# Altium project Buck Converter.PrjPcb
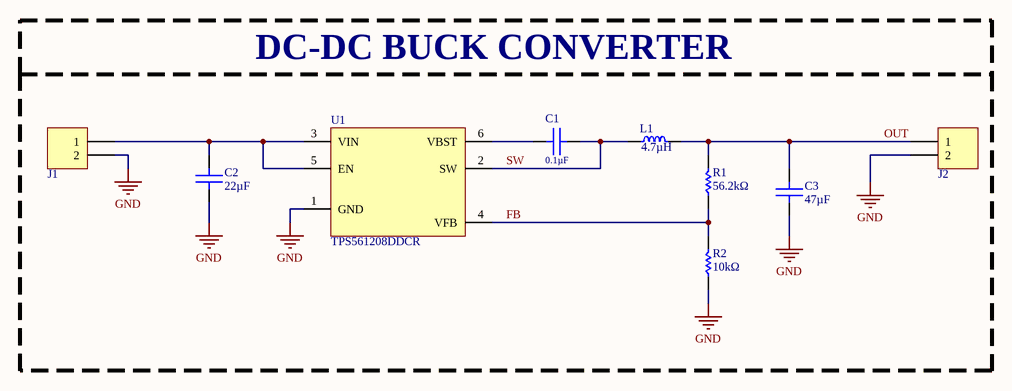
[diagram p0: Buck Converter.SchDoc]
1 sheet, 9 parts. Net scope: global (net labels, ports and power ports of the same name join across sheets).
Board file: Buck Converter.PcbDoc

## Sheet Buck Converter.SchDoc
size A3; SheetNumber: 1; SheetTotal: 1

### Parts
C1  value 0.1µF  [CAP_ALUM_0603]  (hidden comment: CC0603KRX7R9BB104)
C2  value 22µF  [CAP_ALUM_0603]  (hidden comment: GMC10X5R226M16NT)
C3  value 47µF  [CAP_ALUM_0805]  (hidden comment: MLASL21GBB5476MTNA01)
J1  284391-2  [CONNECTOR]  (value not drawn)
J2  284391-2  [CONNECTOR]  (value not drawn)
L1  value 4.7µH  [IND]  (hidden comment: ETQ-P3M4R7KVP)
R1  value 56.2kΩ  [RES_0805]  (hidden comment: ERJ-PB6D5622V)
R2  value 10kΩ  [RES_0805]  (hidden comment: CRCW080510K0FKEA)
U1  TPS561208DDCR  [SOT-23-6]

### Blocks framed on the sheet
DC-DC BUCK CONVERTER: C1-C3 J1 J2 L1 R1 R2 U1

### Nets
GND: C2.1 C3.1 J1.2 J2.2 R2.1 U1.1(GND)
FB: R1.1 R2.2 U1.4(VFB)
OUT: C3.2 J2.1 L1.2 R1.2
SW: C1.2 L1.1 U1.2(SW)
NetC1_1: C1.1 U1.6(VBST)
NetC2_2: C2.2 J1.1 U1.3(VIN) U1.5(EN)

### Notes on the sheet
- Dosya Adı / File Name
- Hazırlayan / Prepared By
- Tanım / Description
- Değiştirme Tarihi / Changed Date
- Bölüm / Department
- Onaylayan / Approved By
- Kontrol Eden / Checked By
- Boyut / Size
- Sayfa / Sheet Number
- Revizyon / Revision

### Library data of the parts
C1 = CAP CER 50V 0.1UF: CAP CER 0.1UF 50V X7R 0603; Designed by: Ali; ComponentLink1URL: https://datasheet.octopart.com:443/CC0603KRX7R9BB104-Yageo-datasheet-177165144.pdf?src-supplier=IHS; ComponentLink1Description: https://datasheet.octopart.com:443/CC0603KRX7R9BB104-Yageo-datasheet-177165144.pdf?src-supplier=IHS; ComponentLink2URL: https://datasheet.octopart.com:443/CC0603KRX7R9BB104-Yageo-datasheet-82288757.pdf?src-supplier=Upverter; ComponentLink2Description: https://datasheet.octopart.com:443/CC0603KRX7R9BB104-Yageo-datasheet-82288757.pdf?src-supplier=Upverter; ComponentLink3URL: https://datasheet.octopart.com:443/CC0603KRX7R9BB104-Yageo-datasheet-68298032.pdf?src-supplier=Upverter; ComponentLink3Description: https://datasheet.octopart.com:443/CC0603KRX7R9BB104-Yageo-datasheet-68298032.pdf?src-supplier=Upverter; ComponentLink4URL: https://datasheet.octopart.com:443/CC0603KRX7R9BB104-Yageo-Group-datasheet-189192896.pdf?src-supplier=Future+Electronics; ComponentLink4Description: https://datasheet.octopart.com:443/CC0603KRX7R9BB104-Yageo-Group-datasheet-189192896.pdf?src-supplier=Future+Electronics; ComponentLink5URL: https://datasheet.octopart.com:443/CC0603KRX7R9BB104-Yageo-datasheet-166511530.pdf?src-supplier=Future+Electronics; ComponentLink5Description: https://datasheet.octopart.com:443/CC0603KRX7R9BB104-Yageo-datasheet-166511530.pdf?src-supplier=Future+Electronics; ComponentLink6URL: https://datasheet.octopart.com:443/CC0603KRX7R9BB104-Yageo-datasheet-137700082.pdf?src-supplier=Future+Electronics; ComponentLink6Description: https://datasheet.octopart.com:443/CC0603KRX7R9BB104-Yageo-datasheet-137700082.pdf?src-supplier=Future+Electronics; ComponentLink7URL: https://datasheet.octopart.com:443/CC0603KRX7R9BB104-Yageo-datasheet-137700084.pdf?src-supplier=Future+Electronics; ComponentLink7Description: https://datasheet.octopart.com:443/CC0603KRX7R9BB104-Yageo-datasheet-137700084.pdf?src-supplier=Future+Electronics; ComponentLink8URL: https://datasheet.octopart.com:443/CC0603KRX7R9BB104-Yageo-datasheet-27626582.pdf?src-supplier=Future+Electronics; ComponentLink8Description: https://datasheet.octopart.com:443/CC0603KRX7R9BB104-Yageo-datasheet-27626582.pdf?src-supplier=Future+Electronics; ComponentLink9URL: https://datasheet.octopart.com:443/CC0603KRX7R9BB104-Yageo-datasheet-15895757.pdf?src-supplier=Future+Electronics; ComponentLink9Description: https://datasheet.octopart.com:443/CC0603KRX7R9BB104-Yageo-datasheet-15895757.pdf?src-supplier=Future+Electronics; ComponentLink10URL: https://datasheet.octopart.com:443/CC0603KRX7R9BB104-Yageo-datasheet-8324192.pdf?src-supplier=Future+Electronics; ComponentLink10Description: https://datasheet.octopart.com:443/CC0603KRX7R9BB104-Yageo-datasheet-8324192.pdf?src-supplier=Future+Electronics; ComponentLink11URL: https://datasheet.octopart.com/CC0603KRX7R9BB104-Yageo-datasheet-10883670.pdf; ComponentLink11Description: https://datasheet.octopart.com/CC0603KRX7R9BB104-Yageo-datasheet-10883670.pdf; ComponentLink12URL: https://datasheet.octopart.com/CC0603KRX7R9BB104-Yageo-datasheet-12526321.pdf; ComponentLink12Description: https://datasheet.octopart.com/CC0603KRX7R9BB104-Yageo-datasheet-12526321.pdf; ComponentLink13URL: https://datasheet.octopart.com:443/CC0603KRX7R9BB104-Yageo-datasheet-181968726.pdf?src-supplier=Newark; ComponentLink13Description: https://datasheet.octopart.com:443/CC0603KRX7R9BB104-Yageo-datasheet-181968726.pdf?src-supplier=Newark; ComponentLink14URL: https://datasheet.octopart.com:443/CC0603KRX7R9BB104-Yageo-datasheet-499490.pdf?src-supplier=Newark; ComponentLink14Description: https://datasheet.octopart.com:443/CC0603KRX7R9BB104-Yageo-datasheet-499490.pdf?src-supplier=Newark; ComponentLink15URL: https://datasheet.octopart.com:443/CC0603KRX7R9BB104-Yageo-datasheet-62336348.pdf?src-supplier=Newark; ComponentLink15Description: https://datasheet.octopart.com:443/CC0603KRX7R9BB104-Yageo-datasheet-62336348.pdf?src-supplier=Newark; ComponentLink16URL: https://datasheet.octopart.com:443/CC0603KRX7R9BB104-Yageo-datasheet-147453679.pdf?src-supplier=Newark; ComponentLink16Description: https://datasheet.octopart.com:443/CC0603KRX7R9BB104-Yageo-datasheet-147453679.pdf?src-supplier=Newark; ComponentLink17URL: https://datasheet.octopart.com:443/CC0603KRX7R9BB104-Yageo-datasheet-151948686.pdf?src-supplier=Farnell; ComponentLink17Description: https://datasheet.octopart.com:443/CC0603KRX7R9BB104-Yageo-datasheet-151948686.pdf?src-supplier=Farnell; ComponentLink18URL: https://datasheet.octopart.com:443/CC0603KRX7R9BB104-Yageo-datasheet-500777.pdf?src-supplier=Farnell; ComponentLink18Description: https://datasheet.octopart.com:443/CC0603KRX7R9BB104-Yageo-datasheet-500777.pdf?src-supplier=Farnell; ComponentLink19URL: https://datasheet.octopart.com:443/CC0603KRX7R9BB104-Yageo-datasheet-178019014.pdf?src-supplier=Burklin+Elektronik; ComponentLink19Description: https://datasheet.octopart.com:443/CC0603KRX7R9BB104-Yageo-datasheet-178019014.pdf?src-supplier=Burklin+Elektronik; ComponentLink20URL: https://datasheet.octopart.com:443/CC0603KRX7R9BB104-Yageo-Group-datasheet-165992755.pdf?src-supplier=ODG+(Origin+Data+Global); ComponentLink20Description: https://datasheet.octopart.com:443/CC0603KRX7R9BB104-Yageo-Group-datasheet-165992755.pdf?src-supplier=ODG+(Origin+Data+Global); ComponentLink21URL: https://datasheet.octopart.com:443/CC0603KRX7R9BB104-Yageo-datasheet-140260305.pdf?src-supplier=SOS+electronic; ComponentLink21Description: https://datasheet.octopart.com:443/CC0603KRX7R9BB104-Yageo-datasheet-140260305.pdf?src-supplier=SOS+electronic; ComponentLink22URL: https://datasheet.octopart.com:443/CC0603KRX7R9BB104-Yageo-datasheet-120101875.pdf?src-supplier=Megastar; ComponentLink22Description: https://datasheet.octopart.com:443/CC0603KRX7R9BB104-Yageo-datasheet-120101875.pdf?src-supplier=Megastar; ComponentLink23URL: https://datasheet.octopart.com:443/CC0603KRX7R9BB104-Yageo-datasheet-8701427.pdf?src-supplier=element14; ComponentLink23Description: https://datasheet.octopart.com:443/CC0603KRX7R9BB104-Yageo-datasheet-8701427.pdf?src-supplier=element14; ComponentLink24URL: https://datasheet.octopart.com:443/CC0603KRX7R9BB104-Yageo-datasheet-5301394.pdf?src-supplier=element14; ComponentLink24Description: https://datasheet.octopart.com:443/CC0603KRX7R9BB104-Yageo-datasheet-5301394.pdf?src-supplier=element14; ComponentLink25URL: https://datasheet.octopart.com:443/CC0603KRX7R9BB104-Yageo-datasheet-17600895.pdf?src-supplier=TME; ComponentLink25Description: https://datasheet.octopart.com:443/CC0603KRX7R9BB104-Yageo-datasheet-17600895.pdf?src-supplier=TME; ComponentLink26URL: http://sigma.octopart.com:80/15889575/rohs_statement/Yageo-CC0603KRX7R9BB104.pdf?src-supplier=Compliance+Statements; ComponentLink26Description: http://sigma.octopart.com:80/15889575/rohs_statement/Yageo-CC0603KRX7R9BB104.pdf?src-supplier=Compliance+Statements; ComponentLink27URL: http://sigma.octopart.com:80/rohs_statement/Surface-Mount-Ceramic-Multilayer-Capacitors%3B-General-Purpose-%26-High-Capacitance-Class-2%2C-X7R-Yageo-family-124.pdf?src-supplier=Compliance+Statements; ComponentLink27Description: http://sigma.octopart.com:80/rohs_statement/Surface-Mount-Ceramic-Multilayer-Capacitors%3B-General-Purpose-%26-High-Capacitance-Class-2%2C-X7R-Yageo-family-124.pdf?src-supplier=Compliance+Statements; ComponentLink28URL: http://sigma.octopart.com:80/reach_statement/Surface-Mount-Ceramic-Multilayer-Capacitors%3B-General-Purpose-%26-High-Capacitance-Class-2%2C-X7R-Yageo-family-125.pdf?src-supplier=Compliance+Statements; ComponentLink28Description: http://sigma.octopart.com:80/reach_statement/Surface-Mount-Ceramic-Multilayer-Capacitors%3B-General-Purpose-%26-High-Capacitance-Class-2%2C-X7R-Yageo-family-125.pdf?src-supplier=Compliance+Statements; ComponentLink29URL: http://sigma.octopart.com:80/conflict_mineral_statement/Yageo-company-3.pdf?src-supplier=Compliance+Statements; ComponentLink29Description: http://sigma.octopart.com:80/conflict_mineral_statement/Yageo-company-3.pdf?src-supplier=Compliance+Statements
C2 = CAP CER 16V 22UF: CAP CER 22UF 16V X5R 0603; Designed by: Ali
C3 = CAP CER 10V 47UF: CAP CER 47UF 10V X5R 0805; Designed by: Ali; ComponentLink1URL: https://datasheet.octopart.com:443/MLASL21GBB5476MTNA01-Taiyo-Yuden-datasheet-182109626.pdf?src-supplier=IHS; ComponentLink1Description: https://datasheet.octopart.com:443/MLASL21GBB5476MTNA01-Taiyo-Yuden-datasheet-182109626.pdf?src-supplier=IHS
J1 J2 = 2POS CONNECTOR: TERM BLK 2POS 3.5MM PCB; Designed by: Ali; ComponentLink1URL: https://datasheet.octopart.com:443/TB006-508-02BE-Same-Sky-datasheet-181920258.pdf?src-supplier=Same+Sky; ComponentLink1Description: https://datasheet.octopart.com:443/TB006-508-02BE-Same-Sky-datasheet-181920258.pdf?src-supplier=Same+Sky; ComponentLink2URL: https://datasheet.octopart.com:443/TB006-508-02BE-CUI-Devices-datasheet-175928139.pdf?src-supplier=Same+Sky; ComponentLink2Description: https://datasheet.octopart.com:443/TB006-508-02BE-CUI-Devices-datasheet-175928139.pdf?src-supplier=Same+Sky; ComponentLink3URL: https://datasheet.octopart.com:443/TB006-508-02BE-CUI-Devices-datasheet-144794960.pdf?src-supplier=Same+Sky; ComponentLink3Description: https://datasheet.octopart.com:443/TB006-508-02BE-CUI-Devices-datasheet-144794960.pdf?src-supplier=Same+Sky; ComponentLink4URL: https://datasheet.octopart.com:443/TB006-508-02BE-CUI-Devices-datasheet-180438495.pdf?src-supplier=IHS; ComponentLink4Description: https://datasheet.octopart.com:443/TB006-508-02BE-CUI-Devices-datasheet-180438495.pdf?src-supplier=IHS; ComponentLink5URL: https://datasheet.octopart.com:443/TB006-508-02BE-Same-Sky-datasheet-182881446.pdf?src-supplier=Electro+Sonic; ComponentLink5Description: https://datasheet.octopart.com:443/TB006-508-02BE-Same-Sky-datasheet-182881446.pdf?src-supplier=Electro+Sonic; ComponentLink6URL: https://datasheet.octopart.com:443/TB006-508-02BE-CUI-Devices-datasheet-154730747.pdf?src-supplier=Electro+Sonic; ComponentLink6Description: https://datasheet.octopart.com:443/TB006-508-02BE-CUI-Devices-datasheet-154730747.pdf?src-supplier=Electro+Sonic; ComponentLink7URL: https://datasheet.octopart.com:443/TB006-508-02BE-CUI-Devices-datasheet-175927972.pdf?src-supplier=CUI+Devices+SCT; ComponentLink7Description: https://datasheet.octopart.com:443/TB006-508-02BE-CUI-Devices-datasheet-175927972.pdf?src-supplier=CUI+Devices+SCT; ComponentLink8URL: https://datasheet.octopart.com:443/TB006-508-02BE-CUI-Devices-datasheet-142371922.pdf?src-supplier=Future+Electronics; ComponentLink8Description: https://datasheet.octopart.com:443/TB006-508-02BE-CUI-Devices-datasheet-142371922.pdf?src-supplier=Future+Electronics; ComponentLink9URL: https://datasheet.octopart.com:443/TB006-508-02BE-Same-Sky-datasheet-182050254.pdf?src-supplier=Future+Electronics; ComponentLink9Description: https://datasheet.octopart.com:443/TB006-508-02BE-Same-Sky-datasheet-182050254.pdf?src-supplier=Future+Electronics; ComponentLink10URL: https://datasheet.octopart.com:443/TB006-508-02BE-CUI-Devices-datasheet-175928504.pdf?src-supplier=Future+Electronics; ComponentLink10Description: https://datasheet.octopart.com:443/TB006-508-02BE-CUI-Devices-datasheet-175928504.pdf?src-supplier=Future+Electronics; ComponentLink11URL: https://datasheet.octopart.com:443/TB006-508-02BE-CUI-Devices-datasheet-147843966.pdf?src-supplier=Future+Electronics; ComponentLink11Description: https://datasheet.octopart.com:443/TB006-508-02BE-CUI-Devices-datasheet-147843966.pdf?src-supplier=Future+Electronics; ComponentLink12URL: https://datasheet.octopart.com:443/TB006-508-02BE-Same-Sky-datasheet-189105716.pdf?src-supplier=Master+Electronics; ComponentLink12Description: https://datasheet.octopart.com:443/TB006-508-02BE-Same-Sky-datasheet-189105716.pdf?src-supplier=Master+Electronics; ComponentLink13URL: https://octopart.com:443/opatz8j6/c1?t=fHsI-vJGq0ax3YV4VPVX9765FQLYLnKawkvhVDY2wGW7NsuHLeMmTTnAN8UF06CQPZs48yB-5xz3sL1w5bxWn8qPeiAw10ubbZDHCopwzJcKDiScSo2o5eGfu6tkPQfY8CPLZDvg6-vEfr5aGAxKfcCfYOMvpy_RDBMuQ-hK4ibS6nRTua2f-pcHEJXDh_hBDeocoF22sNH7d1da-SKWMaMDwrpdFRByHucT0U62h2nK3zIbhpnAiH4iZCnOR73LxqY7SbkS3MsMgNkZjyv03hRFiZl1QedJoj0oJD4YkDR3Iwm0DGh6iMs89pr1KypduVaRs30rPEQo-Hyta07xICoRDgViDZT-o4-05qdJ&src-supplier=Compliance+Statements; ComponentLink13Description: https://octopart.com:443/opatz8j6/c1?t=fHsI-vJGq0ax3YV4VPVX9765FQLYLnKawkvhVDY2wGW7NsuHLeMmTTnAN8UF06CQPZs48yB-5xz3sL1w5bxWn8qPeiAw10ubbZDHCopwzJcKDiScSo2o5eGfu6tkPQfY8CPLZDvg6-vEfr5aGAxKfcCfYOMvpy_RDBMuQ-hK4ibS6nRTua2f-pcHEJXDh_hBDeocoF22sNH7d1da-SKWMaMDwrpdFRByHucT0U62h2nK3zIbhpnAiH4iZCnOR73LxqY7SbkS3MsMgNkZjyv03hRFiZl1QedJoj0oJD4YkDR3Iwm0DGh6iMs89pr1KypduVaRs30rPEQo-Hyta07xICoRDgViDZT-o4-05qdJ&src-supplier=Compliance+Statements; ComponentLink14URL: https://octopart.com:443/opatz8j6/c1?t=dM8eYxaDjL-kaGKmpQdjQWWEnU0blebvyTfTg2Rd3ApnP0UDE0_21QnWTJTGPDp9ytAa8tI3FlrDP95A3o_BkvgjWebh62Rb0h4w5pdUEDvMppSZf9I2FkcMVfX_KODmYkYqAUk2J34LktI7ilXeyahGaPsFEFmJ14Qpe_e4WQb7vSWg98nQTbt98nmPt5nbp9Om0G6lN1r0aO0w1HyXWmIGCs0ZKZYERynt6qeI2t6k4UiW3G0ar8-zdiHltbn3Uug6IoKqAm4iCKe5-FP6rZ7LyBAXLGYUwzzXGEbZlMJyi7fV-f2HbCXfbrUN-lArhVr4RKA0cMCPAVhKnfwYpS3HsZn96be7tbt9nomaLsRb7g&src-supplier=Compliance+Statements; ComponentLink14Description: https://octopart.com:443/opatz8j6/c1?t=dM8eYxaDjL-kaGKmpQdjQWWEnU0blebvyTfTg2Rd3ApnP0UDE0_21QnWTJTGPDp9ytAa8tI3FlrDP95A3o_BkvgjWebh62Rb0h4w5pdUEDvMppSZf9I2FkcMVfX_KODmYkYqAUk2J34LktI7ilXeyahGaPsFEFmJ14Qpe_e4WQb7vSWg98nQTbt98nmPt5nbp9Om0G6lN1r0aO0w1HyXWmIGCs0ZKZYERynt6qeI2t6k4UiW3G0ar8-zdiHltbn3Uug6IoKqAm4iCKe5-FP6rZ7LyBAXLGYUwzzXGEbZlMJyi7fV-f2HbCXfbrUN-lArhVr4RKA0cMCPAVhKnfwYpS3HsZn96be7tbt9nomaLsRb7g&src-supplier=Compliance+Statements; ComponentLink15URL: https://octopart.com:443/opatz8j6/c1?t=bw9KZVLlhUqzXoXFRxbELXwAHqW3rYXbl3kz-D70DphFXaJpKM257BgSLnuP8i28oPvEALo2tZA53BhLcUzl5dRb2JOYxLqfI5xvQrkPOl21mmNK4yZO-iltfw1O2MyUgoFo79I6m7IyZirIkd8BTJ6SXlUH-CcdG805aetUs4r3ebpuYTN5yQUnPf8M5eAN6xCifqBWiRhkVNuklpDjmWbPI3nDwC94Sucq-8REIvVdAtJH-q2SkBY-nLcUgY8rcGenqHU6yf7Y4n9YSf-GElQJbIOiT_i1cykaUrV9Yz4c8IA8EYsemTqzfugObHR9KMsqFN2i-Mp5nta0N661Y-6au3dk2z2tQkVn3QdZ&src-supplier=Compliance+Statements; ComponentLink15Description: https://octopart.com:443/opatz8j6/c1?t=bw9KZVLlhUqzXoXFRxbELXwAHqW3rYXbl3kz-D70DphFXaJpKM257BgSLnuP8i28oPvEALo2tZA53BhLcUzl5dRb2JOYxLqfI5xvQrkPOl21mmNK4yZO-iltfw1O2MyUgoFo79I6m7IyZirIkd8BTJ6SXlUH-CcdG805aetUs4r3ebpuYTN5yQUnPf8M5eAN6xCifqBWiRhkVNuklpDjmWbPI3nDwC94Sucq-8REIvVdAtJH-q2SkBY-nLcUgY8rcGenqHU6yf7Y4n9YSf-GElQJbIOiT_i1cykaUrV9Yz4c8IA8EYsemTqzfugObHR9KMsqFN2i-Mp5nta0N661Y-6au3dk2z2tQkVn3QdZ&src-supplier=Compliance+Statements; ComponentLink16URL: https://octopart.com:443/opatz8j6/c1?t=51W4uELkvxqfUgcIORfpkyxNe7hFBhvZiV9jpN1tEL-YWHEtWaoW2GVQnAOGKJV-z-ol0-_zKhVIcSsi0cDlA68krw4fx2Tll0M7j4YXqaaOkm2YpeImxqaVcoAg0sbXHdHWd_xv5ZmzRu1QU3XJyBCDKJVhl-DkFV-Gbea_txV3WYqFkyjjDBkk5sQEpYYc18TquNJ1WUsD0jPnTO40UBXveCrexaP0Dssqdv973MDQ-gsb1JvuQaNQ02QWuz2AHuz4CQI0jUYr4Q0KYYeTWZS-j8dvoUxhQBS5tGPQW3pLx6CMY7iLvYYpoXat0phkzwFSmDBGFA8ZFzihO1kpn-qdPV396rJrWlhwdY9ORzL6zg&src-supplier=Compliance+Statements; ComponentLink16Description: https://octopart.com:443/opatz8j6/c1?t=51W4uELkvxqfUgcIORfpkyxNe7hFBhvZiV9jpN1tEL-YWHEtWaoW2GVQnAOGKJV-z-ol0-_zKhVIcSsi0cDlA68krw4fx2Tll0M7j4YXqaaOkm2YpeImxqaVcoAg0sbXHdHWd_xv5ZmzRu1QU3XJyBCDKJVhl-DkFV-Gbea_txV3WYqFkyjjDBkk5sQEpYYc18TquNJ1WUsD0jPnTO40UBXveCrexaP0Dssqdv973MDQ-gsb1JvuQaNQ02QWuz2AHuz4CQI0jUYr4Q0KYYeTWZS-j8dvoUxhQBS5tGPQW3pLx6CMY7iLvYYpoXat0phkzwFSmDBGFA8ZFzihO1kpn-qdPV396rJrWlhwdY9ORzL6zg&src-supplier=Compliance+Statements
L1 = IND SMD 4.7UH 4.1A: FIXED IND 4.7UH 4.1A 50.16 MOHM; Manufacturer: Panasonic; Manufacturer Part Number: ETQP3M4R7KVP; Manufacturer Lifecycle Status: ACTIVE; Manufacturer Package Identifier: PCC-M0530M-LP; Part Series: Power Choke Coil for Automotive-LP (MC type); Designed by: Ali; DC Resistance (DCR): 50.16mΩ; Inductance Tolerance: 20%; Number of Circuits: 1; Saturation Current: 6.7A; Shielding: Yes; Test Frequency: 100kHz; Supplier: Farnell; Supplier Part Number: 2545717; RoHS: Compliant; Category: Fixed Inductors; Stock: 3910; Pricing: 10=0,574, 100=0,473, 500=0,413, 1000=0,389, 2000=0,374, 4000=0,348 (EUR); Case/Package: 2220; Composition: Wirewound; Country of Origin: Japan; Export Control Classification Number (ECCN) Code: EAR99; Height: 3mm; Harmonized Tariff Schedule (HTS) Code: 8504.50.80.00; Introduction Date: 2016-06-23; Lifecycle Status: Production; Max Current Rating: 4.1A; Max Operating Temperature: 155°C; Min Operating Temperature: -55°C; Mounting Technology: Surface Mount; Number of Terminals: 2; Packaging: Cut Tape; REACH SVHC: Yes; RMS Current (Irms): 4.1A; Schedule B: 8504500000; ESR: 50.16mΩ; Tolerance: 20%; Width: 5mm; ComponentLink1URL: https://datasheet.octopart.com:443/ETQP3M4R7KVP-Panasonic-datasheet-180975437.pdf?src-supplier=IHS; ComponentLink1Description: https://datasheet.octopart.com:443/ETQP3M4R7KVP-Panasonic-datasheet-180975437.pdf?src-supplier=IHS; ComponentLink2URL: https://datasheet.octopart.com:443/ETQP3M4R7KVP-Panasonic-datasheet-98950113.pdf?src-supplier=Panasonic; ComponentLink2Description: https://datasheet.octopart.com:443/ETQP3M4R7KVP-Panasonic-datasheet-98950113.pdf?src-supplier=Panasonic; ComponentLink3URL: https://datasheet.octopart.com:443/ETQP3M4R7KVP-Panasonic-datasheet-136412728.pdf?src-supplier=Newark; ComponentLink3Description: https://datasheet.octopart.com:443/ETQP3M4R7KVP-Panasonic-datasheet-136412728.pdf?src-supplier=Newark; ComponentLink4URL: https://datasheet.octopart.com:443/ETQP3M4R7KVP-Panasonic-datasheet-65850535.pdf?src-supplier=SOS+electronic; ComponentLink4Description: https://datasheet.octopart.com:443/ETQP3M4R7KVP-Panasonic-datasheet-65850535.pdf?src-supplier=SOS+electronic; ComponentLink5URL: https://datasheet.octopart.com:443/ETQP3M4R7KVP-Panasonic-datasheet-66615529.pdf?src-supplier=element14+APAC; ComponentLink5Description: https://datasheet.octopart.com:443/ETQP3M4R7KVP-Panasonic-datasheet-66615529.pdf?src-supplier=element14+APAC; ComponentLink6URL: https://datasheet.octopart.com:443/ETQP3M4R7KVP-Panasonic-datasheet-78834738.pdf?src-supplier=element14+APAC; ComponentLink6Description: https://datasheet.octopart.com:443/ETQP3M4R7KVP-Panasonic-datasheet-78834738.pdf?src-supplier=element14+APAC; ComponentLink7URL: https://datasheet.octopart.com:443/ETQP3M4R7KVP-Panasonic-datasheet-61114973.pdf?src-supplier=element14+APAC; ComponentLink7Description: https://datasheet.octopart.com:443/ETQP3M4R7KVP-Panasonic-datasheet-61114973.pdf?src-supplier=element14+APAC; ComponentLink8URL: https://sigma.octopart.com:443/150570891/technical_drawing/Panasonic-ETQP3M4R7KVP.pdf?src-supplier=Panasonic+SCT; ComponentLink8Description: https://sigma.octopart.com:443/150570891/technical_drawing/Panasonic-ETQP3M4R7KVP.pdf?src-supplier=Panasonic+SCT; ComponentLink9URL: https://datasheet.octopart.com:443/ETQP3M4R7KVP-Panasonic-datasheet-137675050.pdf?src-supplier=TME; ComponentLink9Description: https://datasheet.octopart.com:443/ETQP3M4R7KVP-Panasonic-datasheet-137675050.pdf?src-supplier=TME; ComponentLink10URL: https://datasheet.octopart.com:443/ETQP3M4R7KVP-Panasonic-datasheet-81843036.pdf?src-supplier=Farnell; ComponentLink10Description: https://datasheet.octopart.com:443/ETQP3M4R7KVP-Panasonic-datasheet-81843036.pdf?src-supplier=Farnell
R1 = RES SMD 56.2K OHM 0805: RES SMD 56.2K OHM 0.5% 1/4W 0805; Designed by: Ali; ComponentLink1URL: https://datasheet.octopart.com:443/RP73PF1J56K2BTDF-TE-Connectivity-datasheet-179148511.pdf?src-supplier=IHS; ComponentLink1Description: https://datasheet.octopart.com:443/RP73PF1J56K2BTDF-TE-Connectivity-datasheet-179148511.pdf?src-supplier=IHS; ComponentLink2URL: https://datasheet.octopart.com:443/RP73PF1J56K2BTDF-TE-Connectivity-datasheet-140899247.pdf?src-supplier=IHS; ComponentLink2Description: https://datasheet.octopart.com:443/RP73PF1J56K2BTDF-TE-Connectivity-datasheet-140899247.pdf?src-supplier=IHS; ComponentLink3URL: https://datasheet.octopart.com:443/RP73PF1J56K2BTDF-Tyco-Electronics-datasheet-11516962.pdf?src-supplier=RS+(Formerly+Allied+Electronics); ComponentLink3Description: https://datasheet.octopart.com:443/RP73PF1J56K2BTDF-Tyco-Electronics-datasheet-11516962.pdf?src-supplier=RS+(Formerly+Allied+Electronics); ComponentLink4URL: https://datasheet.octopart.com:443/6-2176089-7-TE-Connectivity---AMP-datasheet-97102182.pdf?src-supplier=Electro+Sonic; ComponentLink4Description: https://datasheet.octopart.com:443/6-2176089-7-TE-Connectivity---AMP-datasheet-97102182.pdf?src-supplier=Electro+Sonic; ComponentLink5URL: https://datasheet.octopart.com:443/RP73PF1J56K2BTDF-Tyco-Electronics-datasheet-11120217.pdf?src-supplier=Farnell; ComponentLink5Description: https://datasheet.octopart.com:443/RP73PF1J56K2BTDF-Tyco-Electronics-datasheet-11120217.pdf?src-supplier=Farnell
R2 = RES SMD 10K OHM 0805: RES SMD 10K OHM 1% 1/4W 0805; Designed by: Ali; ComponentLink1URL: https://datasheet.octopart.com:443/RNCF0603DTE10K0-Stackpole-Electronics-datasheet-182148124.pdf?src-supplier=IHS; ComponentLink1Description: https://datasheet.octopart.com:443/RNCF0603DTE10K0-Stackpole-Electronics-datasheet-182148124.pdf?src-supplier=IHS; ComponentLink2URL: https://datasheet.octopart.com:443/RNCF0603DTE10K0-Stackpole-Electronics-datasheet-141158876.pdf?src-supplier=Stackpole+Electronics; ComponentLink2Description: https://datasheet.octopart.com:443/RNCF0603DTE10K0-Stackpole-Electronics-datasheet-141158876.pdf?src-supplier=Stackpole+Electronics; ComponentLink3URL: https://datasheet.octopart.com:443/RNCF0603DTE10K0-Stackpole-Electronics-datasheet-12511394.pdf?src-supplier=Stackpole+Electronics; ComponentLink3Description: https://datasheet.octopart.com:443/RNCF0603DTE10K0-Stackpole-Electronics-datasheet-12511394.pdf?src-supplier=Stackpole+Electronics; ComponentLink4URL: https://datasheet.octopart.com:443/RNCF0603DTE10K0-Stackpole-Electronics-datasheet-10788241.pdf?src-supplier=Stackpole+Electronics; ComponentLink4Description: https://datasheet.octopart.com:443/RNCF0603DTE10K0-Stackpole-Electronics-datasheet-10788241.pdf?src-supplier=Stackpole+Electronics; ComponentLink5URL: https://datasheet.octopart.com:443/RNCF0603DTE10K0-Stackpole-Electronics-datasheet-155966811.pdf?src-supplier=Electro+Sonic; ComponentLink5Description: https://datasheet.octopart.com:443/RNCF0603DTE10K0-Stackpole-Electronics-datasheet-155966811.pdf?src-supplier=Electro+Sonic; ComponentLink6URL: https://datasheet.octopart.com:443/RNCF0603DTE10K0-Stackpole-Electronics-datasheet-28504821.pdf?src-supplier=Future+Electronics; ComponentLink6Description: https://datasheet.octopart.com:443/RNCF0603DTE10K0-Stackpole-Electronics-datasheet-28504821.pdf?src-supplier=Future+Electronics; ComponentLink7URL: https://datasheet.octopart.com/RNCF0603DTE10K0-Stackpole-Electronics-datasheet-11755897.pdf; ComponentLink7Description: https://datasheet.octopart.com/RNCF0603DTE10K0-Stackpole-Electronics-datasheet-11755897.pdf; ComponentLink8URL: http://sigma.octopart.com:80/15941409/materials_sheet/Stackpole-Electronics-RNCF0603DTE10K0.pdf?src-supplier=Compliance+Statements; ComponentLink8Description: http://sigma.octopart.com:80/15941409/materials_sheet/Stackpole-Electronics-RNCF0603DTE10K0.pdf?src-supplier=Compliance+Statements; ComponentLink9URL: http://sigma.octopart.com:80/141158212/rohs_statement/Stackpole-Electronics-RNCF0603DTE10K0.pdf?src-supplier=Compliance+Statements; ComponentLink9Description: http://sigma.octopart.com:80/141158212/rohs_statement/Stackpole-Electronics-RNCF0603DTE10K0.pdf?src-supplier=Compliance+Statements; ComponentLink10URL: http://sigma.octopart.com:80/141158211/reach_statement/Stackpole-Electronics-RNCF0603DTE10K0.pdf?src-supplier=Compliance+Statements; ComponentLink10Description: http://sigma.octopart.com:80/141158211/reach_statement/Stackpole-Electronics-RNCF0603DTE10K0.pdf?src-supplier=Compliance+Statements
U1 = BUCK SWITCHING 5V 1A: IC REG BUCK ADJ 1A SOT23; Designed by: Ali; ComponentLink1URL: https://datasheet.octopart.com:443/MLASL21GBB5476MTNA01-Taiyo-Yuden-datasheet-182109626.pdf?src-supplier=IHS; ComponentLink1Description: https://datasheet.octopart.com:443/MLASL21GBB5476MTNA01-Taiyo-Yuden-datasheet-182109626.pdf?src-supplier=IHS; ComponentLink2URL: https://sigma.octopart.com:443/180581133/technical_drawing/Texas-Instruments-TPS561208DDCR.pdf?src-supplier=Texas+Instruments; ComponentLink2Description: https://sigma.octopart.com:443/180581133/technical_drawing/Texas-Instruments-TPS561208DDCR.pdf?src-supplier=Texas+Instruments; ComponentLink3URL: https://octopart.com:443/opatz8j6/c1?t=X-b0HHisZbH55NsDw1gLTTjGk-a9CqkXjLyk6wQz6IvtKiHi1FfcTRZ-jtPM-JOr5bQu5O1dXwOa_G9AG1cqx6Rsj9qm9QhslHmtGULxFHJZTPGvjE1_I1l0IDURebwVyeHa78q0f3R3m6KGSACMzktOannogAKMubn1t5dyydMkdTpKes7VihHz0iTczMjt9sgeRYa2cnbtgERBHX1HsZgUHSomXGLzDOvFgPiL8eazJAh9Y_eBqwfhSyfDQ61ZKEDLnD3ZwxjY4kChkzi6x9zuTSfQYIVKf7rNSEGVDXF1NodZ8MRT7-ePkd6k-SI1Q9SbFhD52LhXQb95D5_CoWV6qrtZuyIjyNSt9hbVxuzVMLcV2Ir8jiAVCph9DZVpHg_8kvDdcA&src-supplier=Texas+Instruments; ComponentLink3Description: https://octopart.com:443/opatz8j6/c1?t=X-b0HHisZbH55NsDw1gLTTjGk-a9CqkXjLyk6wQz6IvtKiHi1FfcTRZ-jtPM-JOr5bQu5O1dXwOa_G9AG1cqx6Rsj9qm9QhslHmtGULxFHJZTPGvjE1_I1l0IDURebwVyeHa78q0f3R3m6KGSACMzktOannogAKMubn1t5dyydMkdTpKes7VihHz0iTczMjt9sgeRYa2cnbtgERBHX1HsZgUHSomXGLzDOvFgPiL8eazJAh9Y_eBqwfhSyfDQ61ZKEDLnD3ZwxjY4kChkzi6x9zuTSfQYIVKf7rNSEGVDXF1NodZ8MRT7-ePkd6k-SI1Q9SbFhD52LhXQb95D5_CoWV6qrtZuyIjyNSt9hbVxuzVMLcV2Ir8jiAVCph9DZVpHg_8kvDdcA&src-supplier=Texas+Instruments; ComponentLink4URL: https://sigma.octopart.com:443/179311906/technical_drawing/Texas-Instruments-TPS561208DDCR.pdf?src-supplier=Texas+Instruments; ComponentLink4Description: https://sigma.octopart.com:443/179311906/technical_drawing/Texas-Instruments-TPS561208DDCR.pdf?src-supplier=Texas+Instruments; ComponentLink5URL: https://sigma.octopart.com:443/159779760/technical_drawing/Texas-Instruments-TPS561208DDCR.pdf?src-supplier=Texas+Instruments; ComponentLink5Description: https://sigma.octopart.com:443/159779760/technical_drawing/Texas-Instruments-TPS561208DDCR.pdf?src-supplier=Texas+Instruments; ComponentLink6URL: https://sigma.octopart.com:443/149167535/technical_drawing/Texas-Instruments-TPS561208DDCR.pdf?src-supplier=Texas+Instruments; ComponentLink6Description: https://sigma.octopart.com:443/149167535/technical_drawing/Texas-Instruments-TPS561208DDCR.pdf?src-supplier=Texas+Instruments; ComponentLink7URL: https://sigma.octopart.com:443/49250152/technical_drawing/Texas-Instruments-TPS561208DDCR.pdf?src-supplier=Texas+Instruments; ComponentLink7Description: https://sigma.octopart.com:443/49250152/technical_drawing/Texas-Instruments-TPS561208DDCR.pdf?src-supplier=Texas+Instruments; ComponentLink8URL: https://datasheet.octopart.com:443/TPS561208DDCR-Texas-Instruments-datasheet-83961351.pdf?src-supplier=Upverter; ComponentLink8Description: https://datasheet.octopart.com:443/TPS561208DDCR-Texas-Instruments-datasheet-83961351.pdf?src-supplier=Upverter; ComponentLink9URL: https://datasheet.octopart.com:443/TPS561208DDCR-Texas-Instruments-datasheet-165804780.pdf?src-supplier=LCSC; ComponentLink9Description: https://datasheet.octopart.com:443/TPS561208DDCR-Texas-Instruments-datasheet-165804780.pdf?src-supplier=LCSC; ComponentLink10URL: https://datasheet.octopart.com:443/TPS561208DDCR-Texas-Instruments-datasheet-159118147.pdf?src-supplier=LCSC; ComponentLink10Description: https://datasheet.octopart.com:443/TPS561208DDCR-Texas-Instruments-datasheet-159118147.pdf?src-supplier=LCSC; ComponentLink11URL: http://sigma.octopart.com:80/reach_statement/Texas-Instruments-company-64.pdf?src-supplier=Compliance+Statements; ComponentLink11Description: http://sigma.octopart.com:80/reach_statement/Texas-Instruments-company-64.pdf?src-supplier=Compliance+Statements; ComponentLink12URL: http://sigma.octopart.com:80/conflict_mineral_statement/Texas-Instruments-company-63.pdf?src-supplier=Compliance+Statements; ComponentLink12Description: http://sigma.octopart.com:80/conflict_mineral_statement/Texas-Instruments-company-63.pdf?src-supplier=Compliance+Statements; Value: TPS561208DDCR